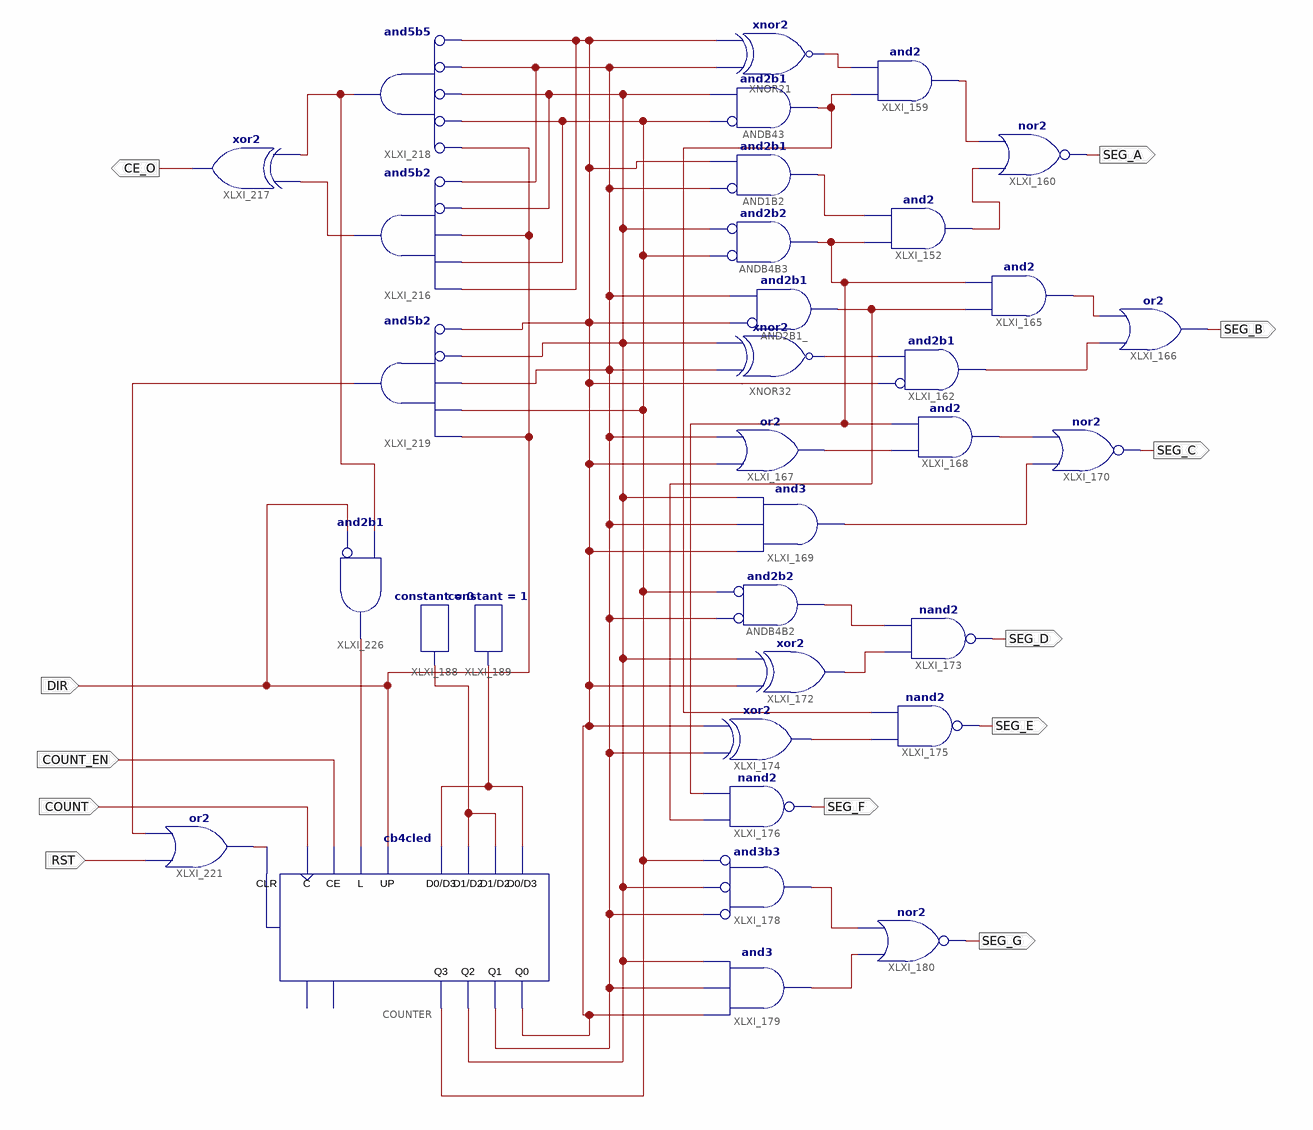
[diagram p0: schematic sheet 1]
// Xilinx ISE schematic i7led_decoder.sch (spartan6) as structural Verilog: 34 symbols, 12 ports
module i7led_decoder (
  input  COUNT,
  input  DIR,
  input  COUNT_EN,
  input  RST,
  output SEG_A,
  output SEG_C,
  output SEG_D,
  output SEG_E,
  output SEG_F,
  output SEG_B,
  output SEG_G,
  output CE_O
);

  wire XLXN_359, XLXN_372, XLXN_373, XLXN_374, XLXN_375, XLXN_377, XLXN_382, XLXN_383, XLXN_385, XLXN_388,
       XLXN_390, XLXN_391, XLXN_392, XLXN_397, XLXN_404, XLXN_408, XLXN_441, XLXN_444, XLXN_475, XLXN_476,
       XLXN_555, XLXN_556, XLXN_560, XLXN_565, XLXN_574, XLXN_575, XLXN_576, XLXN_577, XLXN_578;

  cb4cled COUNTER (
    .C(COUNT), .CE(COUNT_EN), .CLR(XLXN_560), .D0(XLXN_441), .D1(XLXN_444), .D2(XLXN_444), .D3(XLXN_441),
    .L(XLXN_578), .UP(DIR), .Q0(XLXN_575), .Q1(XLXN_577), .Q2(XLXN_576), .Q3(XLXN_574));  // open: CEO, TC
  and ANDB43 (XLXN_373, ~XLXN_574, XLXN_576);  // and2b1
  and XLXI_152 (XLXN_375, XLXN_397, XLXN_359);
  and AND1B2 (XLXN_359, ~XLXN_577, XLXN_575);  // and2b1
  and ANDB4B3 (XLXN_397, ~XLXN_574, ~XLXN_576);  // and2b2
  xnor XNOR21 (XLXN_372, XLXN_577, XLXN_575);
  and XLXI_159 (XLXN_374, XLXN_373, XLXN_372);
  xnor XNOR32 (XLXN_377, XLXN_577, XLXN_576);
  and XLXI_162 (XLXN_383, ~XLXN_575, XLXN_377);  // and2b1
  and AND2B1_ (XLXN_475, ~XLXN_575, XLXN_577);  // and2b1
  and XLXI_165 (XLXN_382, XLXN_475, XLXN_397);
  or XLXI_167 (XLXN_385, XLXN_575, XLXN_577);
  and XLXI_168 (XLXN_390, XLXN_385, XLXN_397);
  and XLXI_169 (XLXN_388, XLXN_575, XLXN_577, XLXN_576);
  nor XLXI_160 (SEG_A, XLXN_375, XLXN_374);
  nor XLXI_170 (SEG_C, XLXN_388, XLXN_390);
  and ANDB4B2 (XLXN_391, ~XLXN_577, ~XLXN_574);  // and2b2
  xor XLXI_172 (XLXN_392, XLXN_575, XLXN_576);
  nand XLXI_173 (SEG_D, XLXN_392, XLXN_391);
  xor XLXI_174 (XLXN_476, XLXN_577, XLXN_575);
  nand XLXI_175 (SEG_E, XLXN_476, XLXN_373);
  nand XLXI_176 (SEG_F, XLXN_475, XLXN_397);
  or XLXI_166 (SEG_B, XLXN_383, XLXN_382);
  and XLXI_178 (XLXN_408, ~XLXN_577, ~XLXN_576, ~XLXN_574);  // and3b3
  and XLXI_179 (XLXN_404, XLXN_575, XLXN_577, XLXN_576);
  nor XLXI_180 (SEG_G, XLXN_404, XLXN_408);
  constant #(.CValue("0")) XLXI_188 (.O(XLXN_444));
  constant #(.CValue("1")) XLXI_189 (.O(XLXN_441));
  and XLXI_216 (XLXN_556, ~XLXN_577, ~XLXN_576, DIR, XLXN_574, XLXN_575);  // and5b2
  xor XLXI_217 (CE_O, XLXN_555, XLXN_556);
  and XLXI_218 (XLXN_555, ~DIR, ~XLXN_574, ~XLXN_576, ~XLXN_577, ~XLXN_575);  // and5b5
  and XLXI_219 (XLXN_565, ~XLXN_575, ~XLXN_576, XLXN_577, XLXN_574, DIR);  // and5b2
  or XLXI_221 (XLXN_560, RST, XLXN_565);
  and XLXI_226 (XLXN_578, ~DIR, XLXN_555);  // and2b1
endmodule
